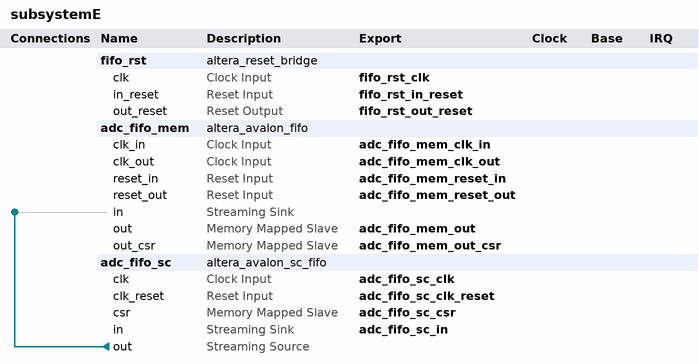
[diagram p0: system contents]
# Platform Designer (Qsys) system subsystemE, Cyclone V 5CSEMA5F31C6
# Parameters at their usual value, and those the tool derives, are not listed.
package require -exact qsys 16.1
create_system subsystemE
set_project_property DEVICE_FAMILY {Cyclone V}
set_project_property DEVICE 5CSEMA5F31C6

add_instance fifo_rst altera_reset_bridge 16.1
set_instance_parameter_value fifo_rst ACTIVE_LOW_RESET 0
set_instance_parameter_value fifo_rst SYNCHRONOUS_EDGES deassert

add_instance adc_fifo_mem altera_avalon_fifo 16.1
set_instance_parameter_value adc_fifo_mem bitsPerSymbol 16
set_instance_parameter_value adc_fifo_mem channelWidth 0
set_instance_parameter_value adc_fifo_mem errorWidth 0
set_instance_parameter_value adc_fifo_mem fifoDepth 8192
set_instance_parameter_value adc_fifo_mem fifoInputInterfaceOptions AVALONST_SINK
set_instance_parameter_value adc_fifo_mem fifoOutputInterfaceOptions AVALONMM_READ
set_instance_parameter_value adc_fifo_mem singleClockMode false
set_instance_parameter_value adc_fifo_mem symbolsPerBeat 2
set_instance_parameter_value adc_fifo_mem useIRQ false
set_instance_parameter_value adc_fifo_mem usePacket false
set_instance_parameter_value adc_fifo_mem useReadControl true
set_instance_parameter_value adc_fifo_mem useWriteControl false

add_instance adc_fifo_sc altera_avalon_sc_fifo 16.1
set_instance_parameter_value adc_fifo_sc BITS_PER_SYMBOL 16
set_instance_parameter_value adc_fifo_sc CHANNEL_WIDTH 0
set_instance_parameter_value adc_fifo_sc ERROR_WIDTH 0
set_instance_parameter_value adc_fifo_sc FIFO_DEPTH 131072
set_instance_parameter_value adc_fifo_sc USE_FILL_LEVEL 1
set_instance_parameter_value adc_fifo_sc USE_MEMORY_BLOCKS 1
set_instance_parameter_value adc_fifo_sc USE_STORE_FORWARD 0

# connections
add_connection adc_fifo_sc.out adc_fifo_mem.in avalon_streaming

# exported interfaces
add_interface adc_fifo_mem_clk_in clock sink
set_interface_property adc_fifo_mem_clk_in EXPORT_OF adc_fifo_mem.clk_in
add_interface adc_fifo_mem_clk_out clock sink
set_interface_property adc_fifo_mem_clk_out EXPORT_OF adc_fifo_mem.clk_out
add_interface adc_fifo_mem_out avalon slave
set_interface_property adc_fifo_mem_out EXPORT_OF adc_fifo_mem.out
add_interface adc_fifo_mem_out_csr avalon slave
set_interface_property adc_fifo_mem_out_csr EXPORT_OF adc_fifo_mem.out_csr
add_interface adc_fifo_mem_reset_in reset sink
set_interface_property adc_fifo_mem_reset_in EXPORT_OF adc_fifo_mem.reset_in
add_interface adc_fifo_mem_reset_out reset sink
set_interface_property adc_fifo_mem_reset_out EXPORT_OF adc_fifo_mem.reset_out
add_interface adc_fifo_sc_clk clock sink
set_interface_property adc_fifo_sc_clk EXPORT_OF adc_fifo_sc.clk
add_interface adc_fifo_sc_clk_reset reset sink
set_interface_property adc_fifo_sc_clk_reset EXPORT_OF adc_fifo_sc.clk_reset
add_interface adc_fifo_sc_csr avalon slave
set_interface_property adc_fifo_sc_csr EXPORT_OF adc_fifo_sc.csr
add_interface adc_fifo_sc_in avalon_streaming sink
set_interface_property adc_fifo_sc_in EXPORT_OF adc_fifo_sc.in
add_interface fifo_rst_clk clock sink
set_interface_property fifo_rst_clk EXPORT_OF fifo_rst.clk
add_interface fifo_rst_in_reset reset sink
set_interface_property fifo_rst_in_reset EXPORT_OF fifo_rst.in_reset
add_interface fifo_rst_out_reset reset source
set_interface_property fifo_rst_out_reset EXPORT_OF fifo_rst.out_reset

set_interconnect_requirement {$system} qsys_mm.clockCrossingAdapter HANDSHAKE
set_interconnect_requirement {$system} qsys_mm.enableEccProtection FALSE
set_interconnect_requirement {$system} qsys_mm.insertDefaultSlave FALSE
set_interconnect_requirement {$system} qsys_mm.maxAdditionalLatency 1

save_system subsystemE.qsys
